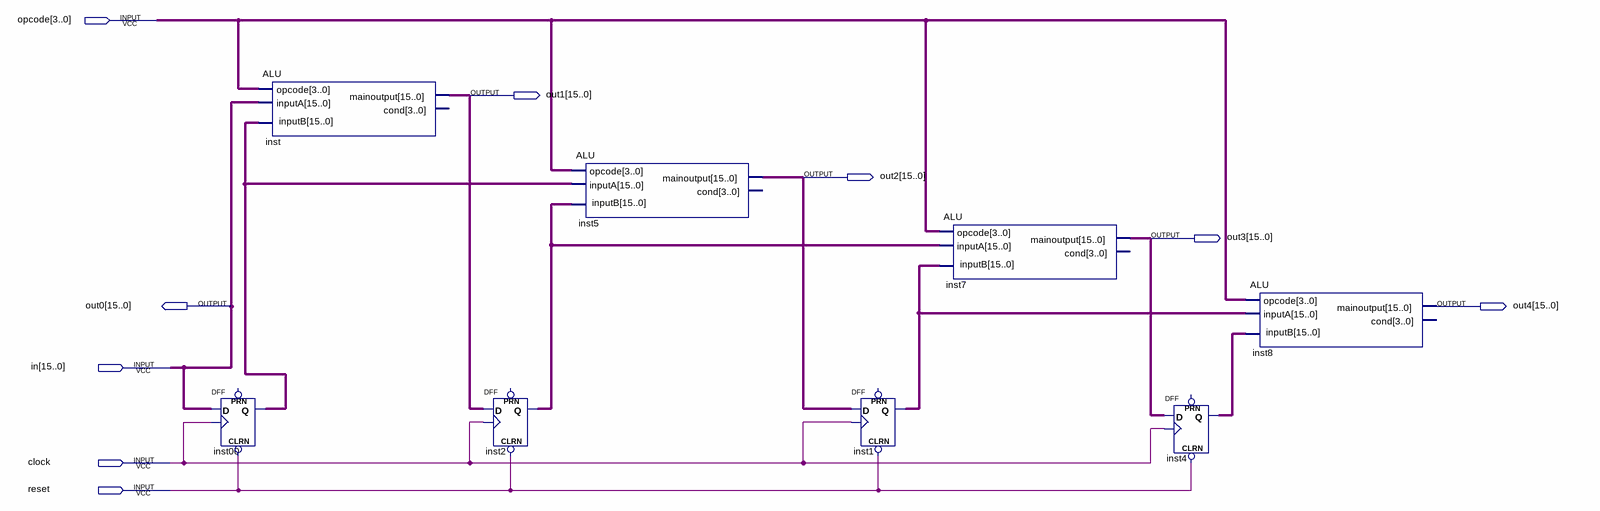
[diagram p0: schematic sheet]
// Quartus schematic main.bdf as structural Verilog: 8 symbols, 9 pins
module main (
  input  [3:0] opcode,
  input  [15:0] in,
  input  clock,
  input  reset,
  output [15:0] out1,
  output [15:0] out2,
  output [15:0] out3,
  output [15:0] out0,
  output [15:0] out4
);

  wire [15:0] inst00_q, inst1_q, inst2_q, inst4_q;

  DFF inst00[15:0] (.CLRN(reset), .CLK(clock), .D(in), .Q(inst00_q));  // open: PRN
  ALU inst (.inputA(in), .inputB(inst00_q), .opcode(opcode), .mainoutput(out1));  // open: cond
  DFF inst2[15:0] (.CLRN(reset), .CLK(clock), .D(out1), .Q(inst2_q));  // open: PRN
  ALU inst5 (.inputA(inst00_q), .inputB(inst2_q), .opcode(opcode), .mainoutput(out2));  // open: cond
  DFF inst1[15:0] (.CLRN(reset), .CLK(clock), .D(out2), .Q(inst1_q));  // open: PRN
  ALU inst7 (.inputA(inst2_q), .inputB(inst1_q), .opcode(opcode), .mainoutput(out3));  // open: cond
  DFF inst4[15:0] (.CLRN(reset), .CLK(clock), .D(out3), .Q(inst4_q));  // open: PRN
  ALU inst8 (.inputA(inst1_q), .inputB(inst4_q), .opcode(opcode), .mainoutput(out4));  // open: cond

  assign out0 = in;
endmodule
